# EAGLE design MAR (EAGLE 9.5.2)
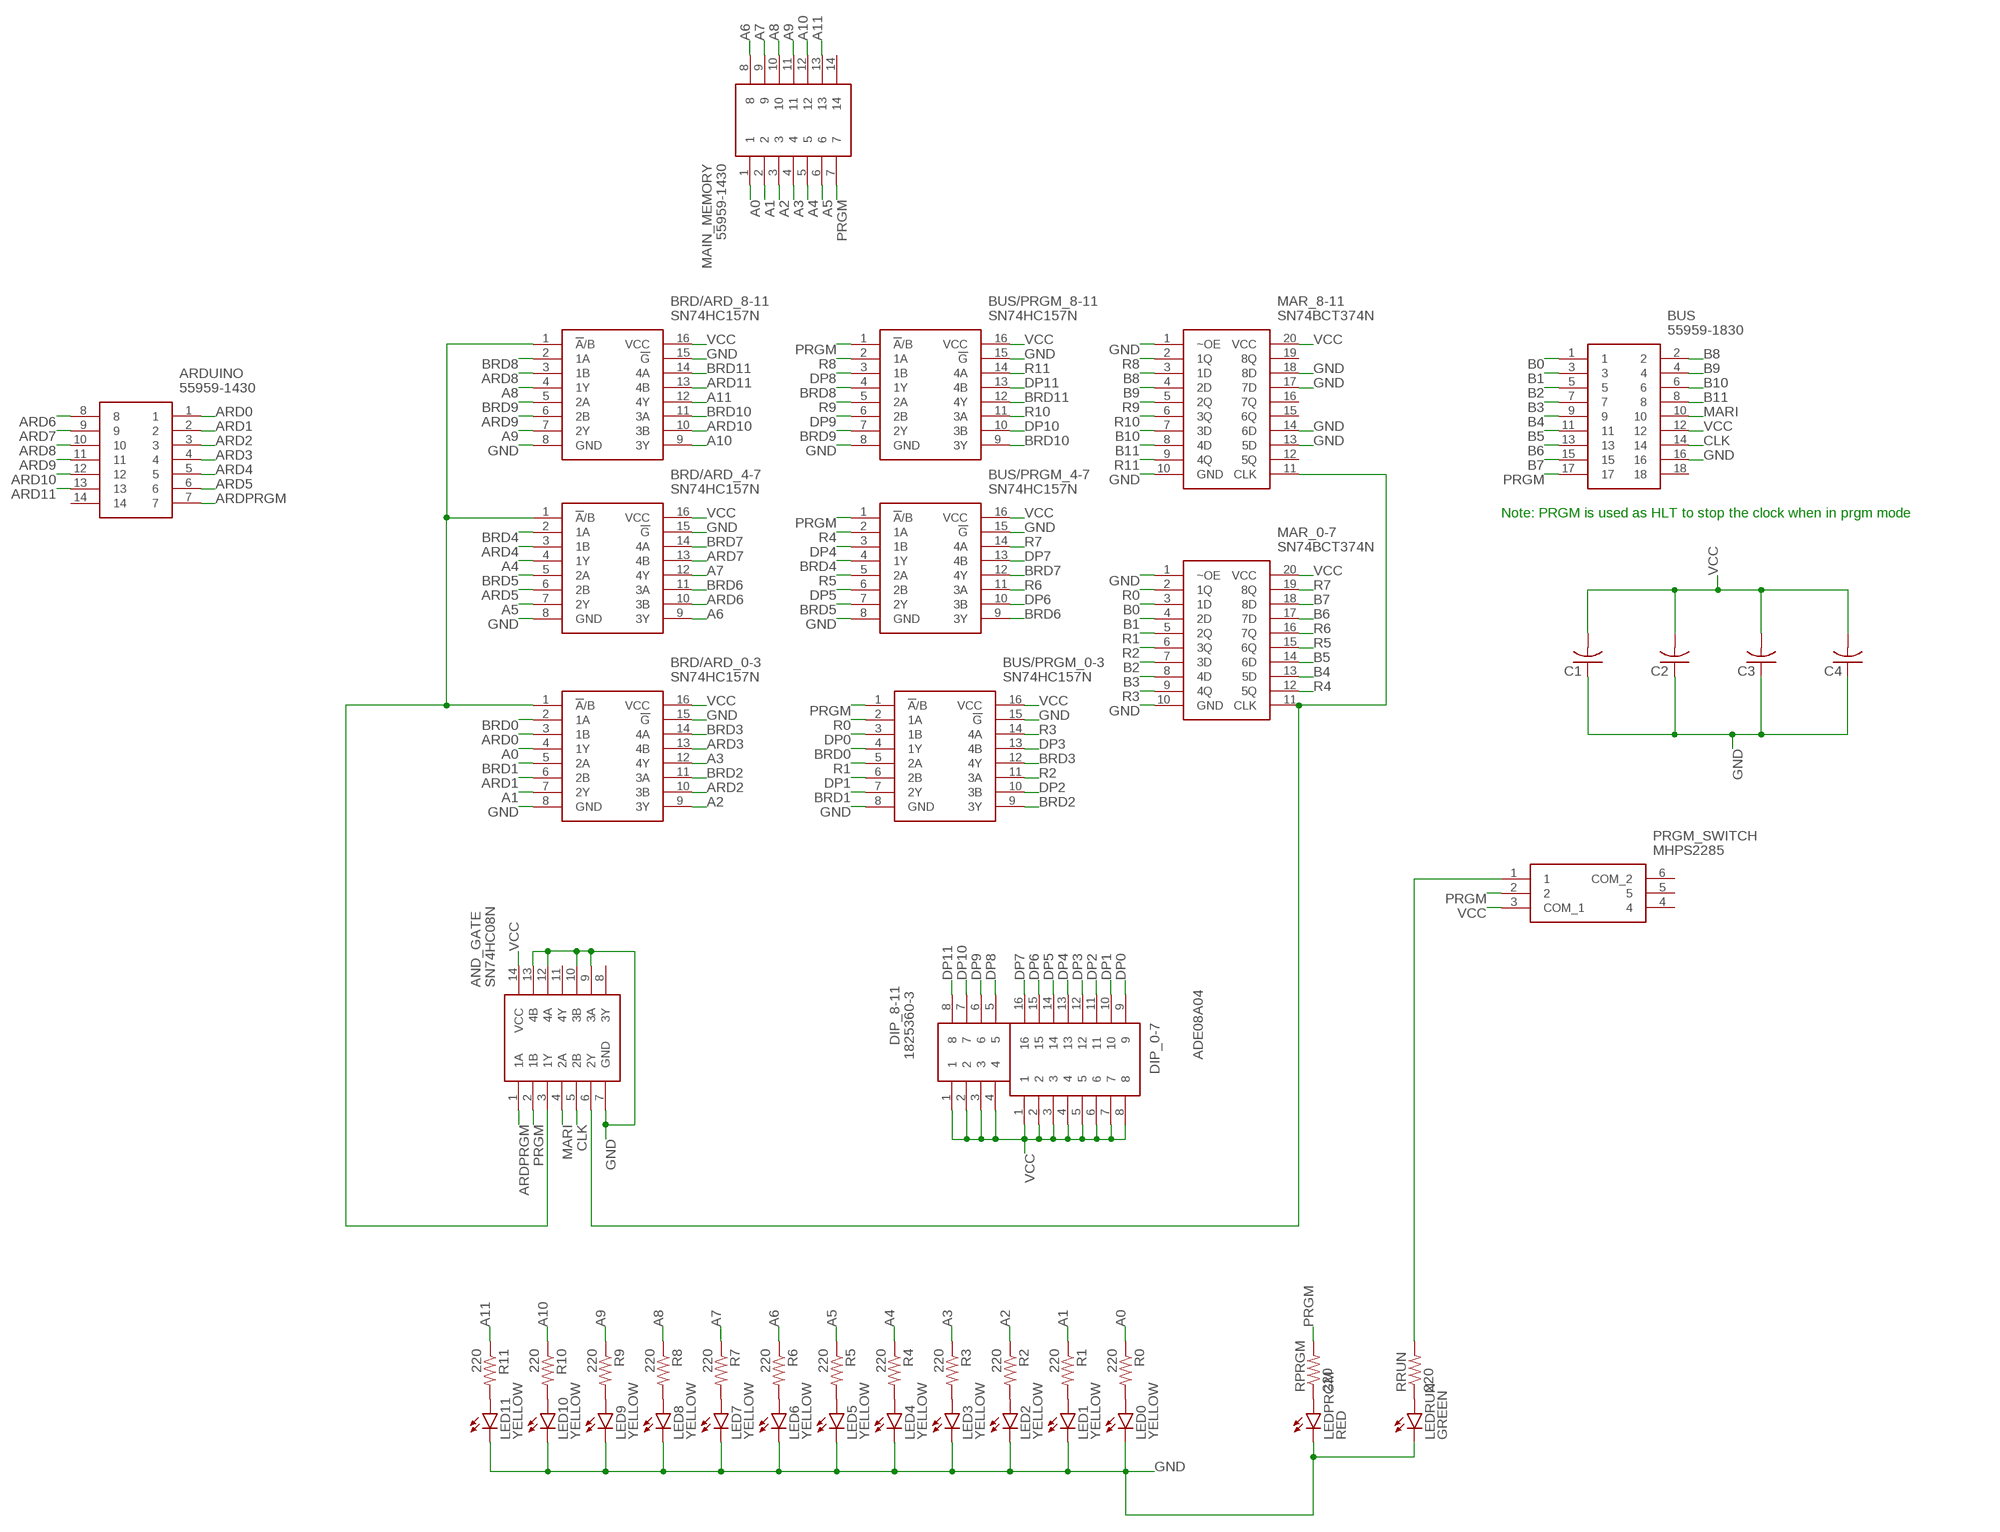
[diagram p0: schematic, sheet 1]

## Parts
AND_GATE  SN74HC08N  [DIP794W53P254L1930H508Q14N]
ARDUINO  55959-1430  [559591430]
BRD/ARD_0-3  SN74HC157N  [DIP794W53P254L1930H508Q16N]
BRD/ARD_4-7  SN74HC157N  [DIP794W53P254L1930H508Q16N]
BRD/ARD_8-11  SN74HC157N  [DIP794W53P254L1930H508Q16N]
BUS  55959-1830  [SHDR18W65P250X200_2X9_2140X140]
BUS/PRGM_0-3  SN74HC157N  [DIP794W53P254L1930H508Q16N]
BUS/PRGM_4-7  SN74HC157N  [DIP794W53P254L1930H508Q16N]
BUS/PRGM_8-11  SN74HC157N  [DIP794W53P254L1930H508Q16N]
C1  C-US025-024X044  [C025-024X044]
C2  C-US025-024X044  [C025-024X044]
C3  C-US025-024X044  [C025-024X044]
C4  C-US025-024X044  [C025-024X044]
DIP_0-7  ADE08A04  [DIP810W60P254L2225H590Q16N]
DIP_8-11  1825360-3  [DIP813W61P254L1209H351Q8N]
LED0  YELLOW  LED3MM  [LED3MM]
LED1  YELLOW  LED3MM  [LED3MM]
LED2  YELLOW  LED3MM  [LED3MM]
LED3  YELLOW  LED3MM  [LED3MM]
LED4  YELLOW  LED3MM  [LED3MM]
LED5  YELLOW  LED3MM  [LED3MM]
LED6  YELLOW  LED3MM  [LED3MM]
LED7  YELLOW  LED3MM  [LED3MM]
LED8  YELLOW  LED3MM  [LED3MM]
LED9  YELLOW  LED3MM  [LED3MM]
LED10  YELLOW  LED3MM  [LED3MM]
LED11  YELLOW  LED3MM  [LED3MM]
LEDPRGM  RED  LED3MM  [LED3MM]
LEDRUN  GREEN  LED3MM  [LED3MM]
MAIN_MEMORY  55959-1430  [559591430]
MAR_0-7  SN74BCT374N  [DIP254P762X508-20]
MAR_8-11  SN74BCT374N  [DIP254P762X508-20]
PRGM_SWITCH  MHPS2285  [MHPS2285]
R0  220  R-US_0204/7  [0204/7]
R1  220  R-US_0204/7  [0204/7]
R2  220  R-US_0204/7  [0204/7]
R3  220  R-US_0204/7  [0204/7]
R4  220  R-US_0204/7  [0204/7]
R5  220  R-US_0204/7  [0204/7]
R6  220  R-US_0204/7  [0204/7]
R7  220  R-US_0204/7  [0204/7]
R8  220  R-US_0204/7  [0204/7]
R9  220  R-US_0204/7  [0204/7]
R10  220  R-US_0204/7  [0204/7]
R11  220  R-US_0204/7  [0204/7]
RPRGM  220  R-US_0204/7  [0204/7]
RRUN  220  R-US_0204/7  [0204/7]

## Nets
A0: BRD/ARD_0-3.4(1Y) MAIN_MEMORY.1 R0.1
A1: BRD/ARD_0-3.7(2Y) MAIN_MEMORY.2 R1.1
A2: BRD/ARD_0-3.9(3Y) MAIN_MEMORY.3 R2.1
A3: BRD/ARD_0-3.12(4Y) MAIN_MEMORY.4 R3.1
A4: BRD/ARD_4-7.4(1Y) MAIN_MEMORY.5 R4.1
A5: BRD/ARD_4-7.7(2Y) MAIN_MEMORY.6 R5.1
A6: BRD/ARD_4-7.9(3Y) MAIN_MEMORY.8 R6.1
A7: BRD/ARD_4-7.12(4Y) MAIN_MEMORY.9 R7.1
A8: BRD/ARD_8-11.4(1Y) MAIN_MEMORY.10 R8.1
A9: BRD/ARD_8-11.7(2Y) MAIN_MEMORY.11 R9.1
A10: BRD/ARD_8-11.9(3Y) MAIN_MEMORY.12 R10.1
A11: BRD/ARD_8-11.12(4Y) MAIN_MEMORY.13 R11.1
ARD0: ARDUINO.1 BRD/ARD_0-3.3(1B)
ARD1: ARDUINO.2 BRD/ARD_0-3.6(2B)
ARD2: ARDUINO.3 BRD/ARD_0-3.10(3B)
ARD3: ARDUINO.4 BRD/ARD_0-3.13(4B)
ARD4: ARDUINO.5 BRD/ARD_4-7.3(1B)
ARD5: ARDUINO.6 BRD/ARD_4-7.6(2B)
ARD6: ARDUINO.8 BRD/ARD_4-7.10(3B)
ARD7: ARDUINO.9 BRD/ARD_4-7.13(4B)
ARD8: ARDUINO.10 BRD/ARD_8-11.3(1B)
ARD9: ARDUINO.11 BRD/ARD_8-11.6(2B)
ARD10: ARDUINO.12 BRD/ARD_8-11.10(3B)
ARD11: ARDUINO.13 BRD/ARD_8-11.13(4B)
ARDPRGM: AND_GATE.1(1A) ARDUINO.7
B0: BUS.1 MAR_0-7.3(1D)
B1: BUS.3 MAR_0-7.4(2D)
B2: BUS.5 MAR_0-7.7(3D)
B3: BUS.7 MAR_0-7.8(4D)
B4: BUS.9 MAR_0-7.13(5D)
B5: BUS.11 MAR_0-7.14(6D)
B6: BUS.13 MAR_0-7.17(7D)
B7: BUS.15 MAR_0-7.18(8D)
B8: BUS.2 MAR_8-11.3(1D)
B9: BUS.4 MAR_8-11.4(2D)
B10: BUS.6 MAR_8-11.7(3D)
B11: BUS.8 MAR_8-11.8(4D)
BRD0: BRD/ARD_0-3.2(1A) BUS/PRGM_0-3.4(1Y)
BRD1: BRD/ARD_0-3.5(2A) BUS/PRGM_0-3.7(2Y)
BRD2: BRD/ARD_0-3.11(3A) BUS/PRGM_0-3.9(3Y)
BRD3: BRD/ARD_0-3.14(4A) BUS/PRGM_0-3.12(4Y)
BRD4: BRD/ARD_4-7.2(1A) BUS/PRGM_4-7.4(1Y)
BRD5: BRD/ARD_4-7.5(2A) BUS/PRGM_4-7.7(2Y)
BRD6: BRD/ARD_4-7.11(3A) BUS/PRGM_4-7.9(3Y)
BRD7: BRD/ARD_4-7.14(4A) BUS/PRGM_4-7.12(4Y)
BRD8: BRD/ARD_8-11.2(1A) BUS/PRGM_8-11.4(1Y)
BRD9: BRD/ARD_8-11.5(2A) BUS/PRGM_8-11.7(2Y)
BRD10: BRD/ARD_8-11.11(3A) BUS/PRGM_8-11.9(3Y)
BRD11: BRD/ARD_8-11.14(4A) BUS/PRGM_8-11.12(4Y)
CLK: AND_GATE.5(2B) BUS.14
DP0: BUS/PRGM_0-3.3(1B) DIP_0-7.9
DP1: BUS/PRGM_0-3.6(2B) DIP_0-7.10
DP2: BUS/PRGM_0-3.10(3B) DIP_0-7.11
DP3: BUS/PRGM_0-3.13(4B) DIP_0-7.12
DP4: BUS/PRGM_4-7.3(1B) DIP_0-7.13
DP5: BUS/PRGM_4-7.6(2B) DIP_0-7.14
DP6: BUS/PRGM_4-7.10(3B) DIP_0-7.15
DP7: BUS/PRGM_4-7.13(4B) DIP_0-7.16
DP8: BUS/PRGM_8-11.3(1B) DIP_8-11.5
DP9: BUS/PRGM_8-11.6(2B) DIP_8-11.6
DP10: BUS/PRGM_8-11.10(3B) DIP_8-11.7
DP11: BUS/PRGM_8-11.13(4B) DIP_8-11.8
GND: AND_GATE.7(GND) AND_GATE.9(3A) AND_GATE.10(3B) AND_GATE.12(4A) AND_GATE.13(4B) BRD/ARD_0-3.8(GND) BRD/ARD_0-3.15(!G) BRD/ARD_4-7.8(GND) BRD/ARD_4-7.15(!G) BRD/ARD_8-11.8(GND) BRD/ARD_8-11.15(!G) BUS.16 BUS/PRGM_0-3.8(GND) BUS/PRGM_0-3.15(!G) BUS/PRGM_4-7.8(GND) BUS/PRGM_4-7.15(!G) BUS/PRGM_8-11.8(GND) BUS/PRGM_8-11.15(!G) C1.1 C2.1 C3.1 C4.1 LED0.K(C) LED1.K(C) LED2.K(C) LED3.K(C) LED4.K(C) LED5.K(C) LED6.K(C) LED7.K(C) LED8.K(C) LED9.K(C) LED10.K(C) LED11.K(C) LEDPRGM.K(C) LEDRUN.K(C) MAR_0-7.1(~OE) MAR_0-7.10(GND) MAR_8-11.1(~OE) MAR_8-11.10(GND) MAR_8-11.13(5D) MAR_8-11.14(6D) MAR_8-11.17(7D) MAR_8-11.18(8D)
MARI: AND_GATE.4(2A) BUS.10
N$1: AND_GATE.3(1Y) BRD/ARD_0-3.1(!A!/B) BRD/ARD_4-7.1(!A!/B) BRD/ARD_8-11.1(!A!/B)
N$2: AND_GATE.6(2Y) MAR_0-7.11(CLK) MAR_8-11.11(CLK)
N$3: LED1.A R1.2
N$4: LED2.A R2.2
N$5: LED3.A R3.2
N$6: LED4.A R4.2
N$7: LED5.A R5.2
N$8: LED6.A R6.2
N$9: LED7.A R7.2
N$10: LED8.A R8.2
N$12: LEDPRGM.A RPRGM.1
N$13: LEDRUN.A RRUN.1
N$14: PRGM_SWITCH.1 RRUN.2
N$15: LED9.A R9.2
N$16: LED10.A R10.2
N$17: LED11.A R11.2
N$22: LED0.A R0.2
PRGM: AND_GATE.2(1B) BUS.17 BUS/PRGM_0-3.1(!A!/B) BUS/PRGM_4-7.1(!A!/B) BUS/PRGM_8-11.1(!A!/B) MAIN_MEMORY.7 PRGM_SWITCH.2 RPRGM.2
R0: BUS/PRGM_0-3.2(1A) MAR_0-7.2(1Q)
R1: BUS/PRGM_0-3.5(2A) MAR_0-7.5(2Q)
R2: BUS/PRGM_0-3.11(3A) MAR_0-7.6(3Q)
R3: BUS/PRGM_0-3.14(4A) MAR_0-7.9(4Q)
R4: BUS/PRGM_4-7.2(1A) MAR_0-7.12(5Q)
R5: BUS/PRGM_4-7.5(2A) MAR_0-7.15(6Q)
R6: BUS/PRGM_4-7.11(3A) MAR_0-7.16(7Q)
R7: BUS/PRGM_4-7.14(4A) MAR_0-7.19(8Q)
R8: BUS/PRGM_8-11.2(1A) MAR_8-11.2(1Q)
R9: BUS/PRGM_8-11.5(2A) MAR_8-11.5(2Q)
R10: BUS/PRGM_8-11.11(3A) MAR_8-11.6(3Q)
R11: BUS/PRGM_8-11.14(4A) MAR_8-11.9(4Q)
VCC: AND_GATE.14(VCC) BRD/ARD_0-3.16(VCC) BRD/ARD_4-7.16(VCC) BRD/ARD_8-11.16(VCC) BUS.12 BUS/PRGM_0-3.16(VCC) BUS/PRGM_4-7.16(VCC) BUS/PRGM_8-11.16(VCC) C1.2 C2.2 C3.2 C4.2 DIP_0-7.1 DIP_0-7.2 DIP_0-7.3 DIP_0-7.4 DIP_0-7.5 DIP_0-7.6 DIP_0-7.7 DIP_0-7.8 DIP_8-11.1 DIP_8-11.2 DIP_8-11.3 DIP_8-11.4 MAR_0-7.20(VCC) MAR_8-11.20(VCC) PRGM_SWITCH.3(COM_1)
Unconnected: AND_GATE.8(3Y) AND_GATE.11(4Y) ARDUINO.14 BUS.18 MAIN_MEMORY.14 MAR_8-11.12(5Q) MAR_8-11.15(6Q) MAR_8-11.16(7Q) MAR_8-11.19(8Q) PRGM_SWITCH.4 PRGM_SWITCH.5 PRGM_SWITCH.6(COM_2)

## Notes on the sheet
- Note: PRGM is used as HLT to stop the clock when in prgm mode

## Library data of the parts
AND_GATE = SamacSys_Parts:SN74HC08N: QUADRUPLE 2-INPUT POSITIVE-NOR GATES Source: Datasheet <http://componentsearchengine.com/Datasheets/1/SN74HC08N.pdf>; DESCRIPTION: QUADRUPLE 2-INPUT POSITIVE-NOR GATES; HEIGHT: 5.08mm; MANUFACTURER_NAME: Texas Instruments; MANUFACTURER_PART_NUMBER: SN74HC08N; MOUSER_PART_NUMBER: 595-SN74HC08N; MOUSER_PRICE-STOCK: https://www.mouser.com/Search/Refine.aspx?Keyword=595-SN74HC08N
ARDUINO MAIN_MEMORY = SamacSys_Parts:55959-1430: Molex MICROCLASP 55959, 2mm Pitch, 14 Way, 2 Row, Right Angle PCB Header, Through Hole Source: Datasheet <https://componentsearchengine.com/Datasheets/1/55959-1430.pdf>; DESCRIPTION: Molex MICROCLASP 55959, 2mm Pitch, 14 Way, 2 Row, Right Angle PCB Header, Through Hole; HEIGHT: 11.7mm; MANUFACTURER_NAME: Molex; MANUFACTURER_PART_NUMBER: 55959-1430; MOUSER_PART_NUMBER: 538-55959-1430; MOUSER_PRICE-STOCK: https://www.mouser.com/Search/Refine.aspx?Keyword=538-55959-1430
BRD/ARD_0-3 BRD/ARD_4-7 BRD/ARD_8-11 BUS/PRGM_0-3 BUS/PRGM_4-7 BUS/PRGM_8-11 = SamacSys_Parts:SN74HC157N: Quadruple 2-Line To 1-Line Data Selectors/Multiplexers Source: Datasheet <http://www.ti.com/lit/gpn/sn74hc157>; DESCRIPTION: Quadruple 2-Line To 1-Line Data Selectors/Multiplexers; HEIGHT: 5.08mm; MANUFACTURER_NAME: Texas Instruments; MANUFACTURER_PART_NUMBER: SN74HC157N; MOUSER_PART_NUMBER: 595-SN74HC157N; MOUSER_PRICE-STOCK: https://www.mouser.com/Search/Refine.aspx?Keyword=595-SN74HC157N
BUS = SamacSys_Parts:55959-1830: Molex MICROCLASP Series, Series Number 55959, 2mm Pitch 18 Way 2 Row Right Angle PCB Header, Solder Termination, 3A Source: Datasheet <https://componentsearchengine.com/Datasheets/1/55959-1830.pdf>; DESCRIPTION: Molex MICROCLASP Series, Series Number 55959, 2mm Pitch 18 Way 2 Row Right Angle PCB Header, Solder Termination, 3A; HEIGHT: 11.7mm; MANUFACTURER_NAME: Molex; MANUFACTURER_PART_NUMBER: 55959-1830; MOUSER_PART_NUMBER: 538-55959-1830; MOUSER_PRICE-STOCK: https://www.mouser.com/Search/Refine.aspx?Keyword=538-55959-1830
C1-C4 = rcl:C-US: CAPACITOR, American symbol; SPICEPREFIX: C
DIP_0-7 = SamacSys_Parts:ADE08A04: 8 Way Through Hole DIP Switch SPST, Extended Slide Actuator Source: Datasheet <https://componentsearchengine.com/Datasheets/1/ADE08A04.pdf>; DESCRIPTION: 8 Way Through Hole DIP Switch SPST, Extended Slide Actuator; HEIGHT: 5.9mm; MANUFACTURER_NAME: TE Connectivity; MANUFACTURER_PART_NUMBER: ADE08A04; MOUSER_PART_NUMBER: 506-ADE08A04; MOUSER_PRICE-STOCK: https://www.mouser.com/Search/Refine.aspx?Keyword=506-ADE08A04
DIP_8-11 = SamacSys_Parts:1825360-3: DIP switch,PCB,SPST,4 pos,extended slide Source: Datasheet <https://componentsearchengine.com/Datasheets/1/1825360-3.pdf>; DESCRIPTION: DIP switch,PCB,SPST,4 pos,extended slide; HEIGHT: 3.51mm; MANUFACTURER_NAME: TE Connectivity; MANUFACTURER_PART_NUMBER: 1825360-3; MOUSER_PART_NUMBER: 506-1825360-3; MOUSER_PRICE-STOCK: https://www.mouser.com/Search/Refine.aspx?Keyword=506-1825360-3
LED0 LED1-LED11 LEDPRGM LEDRUN = led:LED: LED OSRAM: - CHIPLED LG R971, LG N971, LY N971, LG Q971, LY Q971, LO R971, LY R971 LH N974, LH R974 LS Q976, LO Q976, LY Q976 LO Q996 - Hyper CHIPLED LW Q18S LB Q993, LB Q99A, LB R99A - SideLED LS A670, LO A670, LY A670, LG A670, LP A670 LB A673, LV A673, LT A673, LW A673 LH A674 LY A675 LS A676, LA A676, LO A676, LY A676, LW A676 LS A679, LY A679, LG A679 - Hyper Micro SIDELED® LS Y876, LA Y876, LO Y876, LY Y876 LT Y87S - SmartLED LW L88C, LW L88S LB L89C, LB L89S, LG L890 LS L89K, LO L89K, LY L89K LS L896, LA L896, LO L896, LY L896 - TOPLED LS T670, LO T670, LY T670, LG T670, LP T670 LSG T670, LSP T670, LSY T670, LOP T670, LYG T670 LG T671, LOG T671, LSG T671 LB T673, LV T673, LT T673, LW T673 LH T674 LS T676, LA T676, LO T676, LY T676, LB T676, LH T676, LSB T676, LW T676 LB T67C, LV T67C, LT T67C, LS T67K, LO T67K, LY T67K, LW E67C LS E67B, LA E67B, LO E67B, LY E67B, LB E67C, LV E67C, LT E67C LW T67C LS T679, LY T679, LG T679 LS T770, LO T770, LY T770, LG T770, LP T770 LB T773, LV T773, LT T773, LW T773 LH T774 LS E675, LA E675, LY E675, LS T675 LS T776, LA T776, LO T776, LY T776, LB T776 LHGB T686 LT T68C, LB T68C - Hyper Mini TOPLED® LB M676 - Mini TOPLED Santana® LG M470 LS M47K, LO M47K, LY M47K Source: http://www.osram.convergy.de LUXEON: - LUMILED® LXK2-PW12-R00, LXK2-PW12-S00, LXK2-PW14-U00, LXK2-PW14-V00 LXK2-PM12-R00, LXK2-PM12-S00, LXK2-PM14-U00 LXK2-PE12-Q00, LXK2-PE12-R00, LXK2-PE12-S00, LXK2-PE14-T00, LXK2-PE14-U00 LXK2-PB12-K00, LXK2-PB12-L00, LXK2-PB12-M00, LXK2-PB14-N00, LXK2-PB14-P00, LXK2-PB14-Q00 LXK2-PR12-L00, LXK2-PR12-M00, LXK2-PR14-Q00, LXK2-PR14-R00 LXK2-PD12-Q00, LXK2-PD12-R00, LXK2-PD12-S00 LXK2-PH12-R00, LXK2-PH12-S00 LXK2-PL12-P00, LXK2-PL12-Q00, LXK2-PL12-R00 Source: www.luxeon.com KINGBRIGHT: KA-3528ASYC Source: www.kingbright.com
MAR_0-7 MAR_8-11 = SamacSys_Parts:SN74BCT374N: OCTAL EDGE TRIGGERED D TYPE LATCHES Source: Datasheet; DESCRIPTION: OCTAL EDGE TRIGGERED D TYPE LATCHES; HEIGHT: mm; MANUFACTURER_NAME: Texas Instruments; MANUFACTURER_PART_NUMBER: SN74BCT374N; MOUSER_PART_NUMBER: 595-SN74BCT374N; MOUSER_PRICE-STOCK: https://www.mouser.com/Search/Refine.aspx?Keyword=595-SN74BCT374N
PRGM_SWITCH = SamacSys_Parts:MHPS2285: Pushbutton Switches 8mmDPDT PUSH PUSH Source: Datasheet <https://componentsearchengine.com/Datasheets/1/MHPS2285.pdf>; DESCRIPTION: Pushbutton Switches 8mmDPDT PUSH PUSH; HEIGHT: 13.5mm; MANUFACTURER_NAME: Apem; MANUFACTURER_PART_NUMBER: MHPS2285; MOUSER_PART_NUMBER: 642-MHPS2285; MOUSER_PRICE-STOCK: https://www.mouser.com/Search/Refine.aspx?Keyword=642-MHPS2285
R0 R1-R11 RPRGM RRUN = rcl:R-US_: RESISTOR, American symbol; SPICEPREFIX: R

## Board
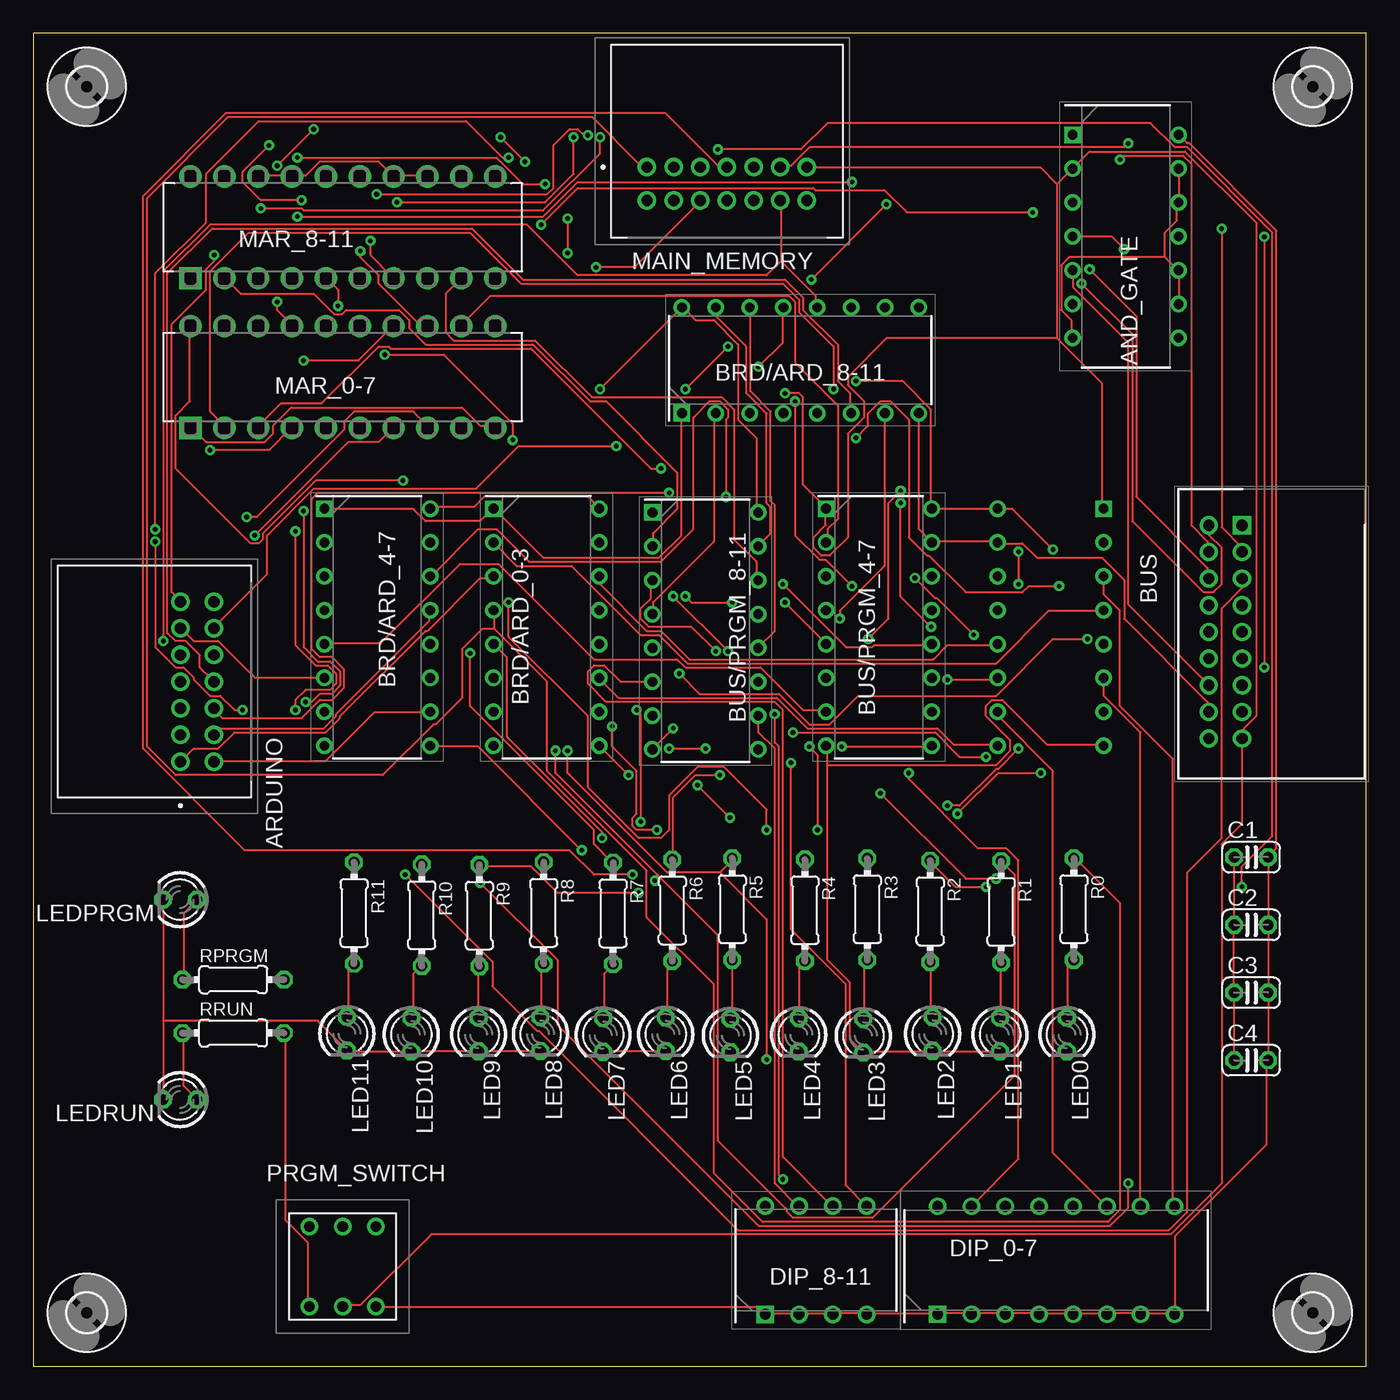
[diagram p1: board, top side]
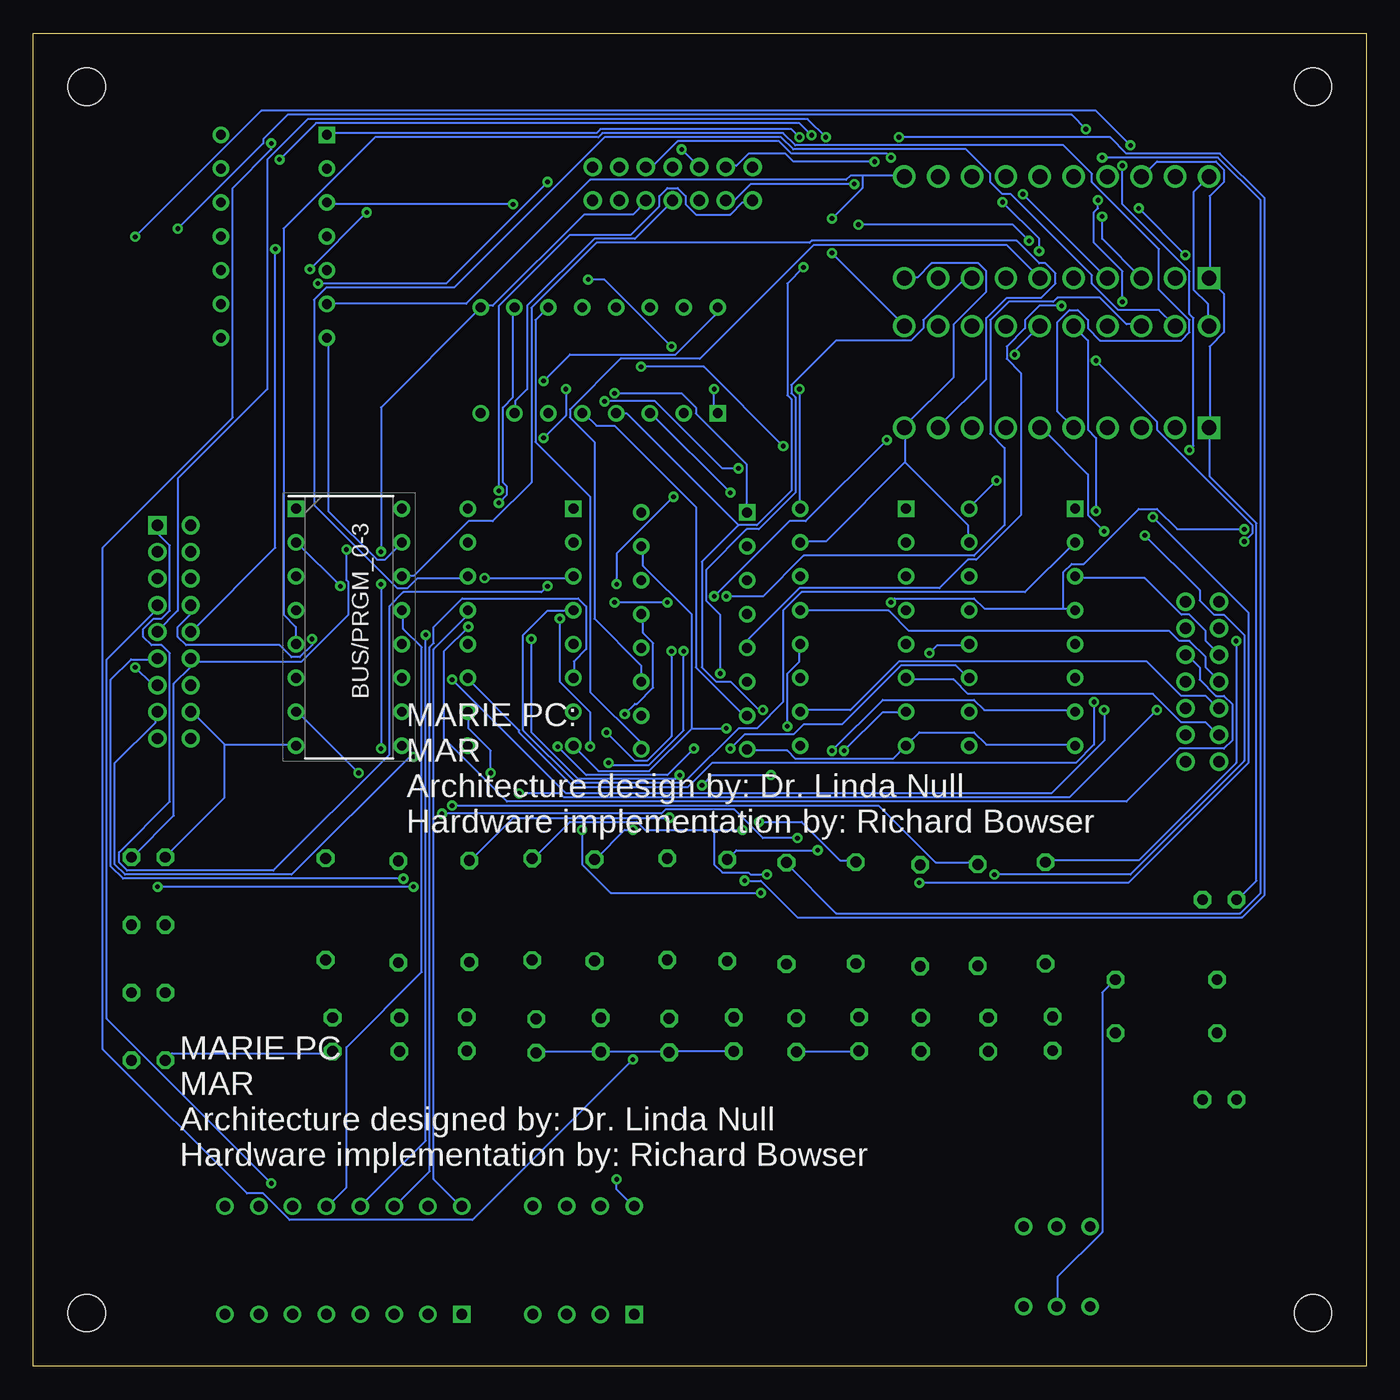
[diagram p2: board, bottom side, seen from below]

Size 100 x 100 mm. Coordinates in mm from the lower left corner, seen from the top.
Outline: 0,0 100,0 100,100 0,100 0,0
Copper layers (1*16): Top 0.035mm / dielectric 1.5mm / Bottom 0.035mm
Design rules "default": minimum track width 6mil, minimum drill 0.35mm, track to track 6mil, track to pad 6mil, pad to pad 6mil, via to via 6mil, smd to smd 6mil, copper to edge 40mil, drill to drill 6mil, minimum pad ring 10mil, minimum via ring 8mil, stop-mask expansion 4mil, vias tented up to drill 0mil, thermal gap 10mil

### Footprints (pad centres in the part's own frame; a part is rotated, then mirrored left to right if it is on the bottom)
DIP794W53P254L1930H508Q14N = drill 0.73 pad 1.13 square: 1 -3.97,7.62 | drill 0.73 pad 1.13: 2 -3.97,5.08; 3 -3.97,2.54; 4 -3.97,0; 5 -3.97,-2.54; 6 -3.97,-5.08; 7 -3.97,-7.62; 8 3.97,-7.62; 9 3.97,-5.08; 10 3.97,-2.54; 11 3.97,0; 12 3.97,2.54; 13 3.97,5.08; 14 3.97,7.62
559591430 = drill 0.85 pad 1.381: 1 0,0; 2 2,0; 3 4,0; 4 6,0; 5 8,0; 6 10,0; 7 12,0; 8 0,-2.5; 9 2,-2.5; 10 4,-2.5; 11 6,-2.5; 12 8,-2.5; 13 10,-2.5; 14 12,-2.5
DIP794W53P254L1930H508Q16N = drill 0.73 pad 1.13 square: 1 -3.97,8.89 | drill 0.73 pad 1.13: 2 -3.97,6.35; 3 -3.97,3.81; 4 -3.97,1.27; 5 -3.97,-1.27; 6 -3.97,-3.81; 7 -3.97,-6.35; 8 -3.97,-8.89; 9 3.97,-8.89; 10 3.97,-6.35; 11 3.97,-3.81; 12 3.97,-1.27; 13 3.97,1.27; 14 3.97,3.81; 15 3.97,6.35; 16 3.97,8.89
SHDR18W65P250X200_2X9_2140X140 = drill 0.85 pad 1.275 square: 1 0,0 | drill 0.85 pad 1.275: 2 0,-2.5; 3 2,0; 4 2,-2.5; 5 4,0; 6 4,-2.5; 7 6,0; 8 6,-2.5; 9 8,0; 10 8,-2.5; 11 10,0; 12 10,-2.5; 13 12,0; 14 12,-2.5; 15 14,0; 16 14,-2.5; 17 16,0; 18 16,-2.5
C025-024X044 = drill 0.813 octagon: 1 -1.27,0; 2 1.27,0
DIP810W60P254L2225H590Q16N = drill 0.8 pad 1.2 square: 1 -4.05,8.89 | drill 0.8 pad 1.2: 2 -4.05,6.35; 3 -4.05,3.81; 4 -4.05,1.27; 5 -4.05,-1.27; 6 -4.05,-3.81; 7 -4.05,-6.35; 8 -4.05,-8.89; 9 4.05,-8.89; 10 4.05,-6.35; 11 4.05,-3.81; 12 4.05,-1.27; 13 4.05,1.27; 14 4.05,3.81; 15 4.05,6.35; 16 4.05,8.89
DIP813W61P254L1209H351Q8N = drill 0.81 pad 1.21 square: 1 -4.065,3.81 | drill 0.81 pad 1.21: 2 -4.065,1.27; 3 -4.065,-1.27; 4 -4.065,-3.81; 5 4.065,-3.81; 6 4.065,-1.27; 7 4.065,1.27; 8 4.065,3.81
LED3MM = drill 0.813 octagon: A -1.27,0; K 1.27,0
DIP254P762X508-20 = drill 1.118 pad 1.676 square: 1 -7.62,22.86 | drill 1.118 pad 1.676: 2 -7.62,20.32; 3 -7.62,17.78; 4 -7.62,15.24; 5 -7.62,12.7; 6 -7.62,10.16; 7 -7.62,7.62; 8 -7.62,5.08; 9 -7.62,2.54; 10 -7.62,0; 11 0,0; 12 0,2.54; 13 0,5.08; 14 0,7.62; 15 0,10.16; 16 0,12.7; 17 0,15.24; 18 0,17.78; 19 0,20.32; 20 0,22.86
MHPS2285 = drill 0.8 pad 1.3: 1 0,0; 2 2.5,0; 3 5,0; 4 5,6; 5 2.5,6; 6 0,6
0204/7 = drill 0.813 octagon: 1 -3.81,0; 2 3.81,0
2,8 = hole 2.8: 0,0

### Placement (x,y rotation side)
AND_GATE  81.95,84.77 0 top
ARDUINO  11.04,45.36 90 top
BRD/ARD_0-3  38.5,55.45 0 top
BRD/ARD_4-7  25.8,55.45 0 top
BRD/ARD_8-11  57.55,75.47 90 top
BUS  90.69,63.09 270 top
BUS/PRGM_0-3  76.32,55.45 0 bottom
BUS/PRGM_4-7  63.44,55.45 0 top
BUS/PRGM_8-11  50.42,55.16 0 top
C1  91.37,38.19 0 top
C2  91.37,33.11 0 top
C3  91.37,28.03 0 top
C4  91.37,22.95 0 top
DIP_0-7  76.74,7.95 90 top
DIP_8-11  58.72,7.95 90 top
LED0  77.54,24.88 270 top
LED1  72.53,24.89 270 top
LED2  67.47,24.93 270 top
LED3  62.27,24.78 270 top
LED4  57.42,24.86 270 top
LED5  52.3,24.81 270 top
LED6  47.45,24.9 270 top
LED7  42.75,24.85 270 top
LED8  38.05,24.92 270 top
LED9  33.41,24.89 270 top
LED10  28.35,24.88 270 top
LED11  23.52,24.94 270 top
LEDPRGM  11,35 180 top
LEDRUN  11,20 180 top
MAIN_MEMORY  46.04,89.96 0 top
MAR_0-7  34.65,78.03 90 top
MAR_8-11  34.65,89.25 90 top
PRGM_SWITCH  20.71,4.47 0 top
R0  78.07,34.3 270 top
R1  72.61,34.09 270 top
R2  67.29,34.12 270 top
R3  62.58,34.28 270 top
R4  57.89,34.2 270 top
R5  52.44,34.29 270 top
R6  47.94,34.2 270 top
R7  43.49,33.98 270 top
R8  38.29,34.01 270 top
R9  33.46,33.8 270 top
R10  29.14,33.84 270 top
R11  24.06,34 270 top
RPRGM  15,29 0 top
RRUN  15,25 0 top
U$1  [2,8]  4,4 0 top
U$2  [2,8]  96,4 0 top
U$3  [2,8]  96,96 0 top
U$4  [2,8]  4,96 0 top

### Tracks (layer width: path | path; a pad name or v marks a point on that pad's centre or on a via)
A0
  Top 0.152: 34.59,55.32 34.59,56.69 BRD/ARD_0-3.4 | 34.59,55.32 38.56,51.36 38.56,44.65 46.02,37.19 46.02,33.68 51.05,28.65 51.05,14.48 54.71,10.82 80.62,10.82 81.53,11.73 81.53,34.75 78.18,38.1 R0.1 | 34.59,55.32 33.68,55.32 32.16,53.8 32.16,50.14 30.18,48.16 30.02,48.16 26.21,44.35 10.67,44.35 8.53,46.48 8.53,87.63 14.63,93.73 41.91,93.73 45.57,90.07 46.02,90.07 MAIN_MEMORY.1
A1  (via drill 0.35)
  Top 0.152: v39.17,46.18 39.17,44.5 46.94,36.73 | 46.94,36.73 51.36,32.31 51.36,16.92 56.54,11.73 56.54,11.58 57,11.12 62.94,11.12 73.61,21.79 73.61,36.88 72.69,37.8 R1.1 | v35.05,92.2 v36.88,90.37 | 46.94,36.73 v46.63,36.42
  Bottom 0.152: v39.17,46.18 36.27,49.07 34.59,49.07 BRD/ARD_0-3.7 | v36.88,90.37 42.98,90.37 43.59,90.98 46.33,90.98 47.24,90.07 48.01,90.07 MAIN_MEMORY.2 | v35.05,92.2 19.2,92.2 17.98,90.98 10.97,90.98 7.62,87.63 7.62,35.36 9.3,33.68 42.67,33.68 45.41,36.42 v46.63,36.42
A2  (via drill 0.35)
  Top 0.152: v44.65,44.35 42.52,46.48 BRD/ARD_0-3.9 | v52.27,41.15 v49.84,43.59 | v51.36,91.29 57.61,91.29 59.59,93.27 83.82,93.27 85.65,91.44 86.56,91.44 92.96,85.04 92.96,39.78 90.68,37.49 v90.68,35.97 | v71.48,35.97 69.19,35.97 67.36,37.8 R2.1
  Bottom 0.152: v44.65,44.35 49.07,44.35 v49.84,43.59 | v52.27,41.15 64.01,41.15 67.21,37.95 R2.1 | v51.36,91.29 50.14,90.07 MAIN_MEMORY.3 | v71.48,35.97 v90.68,35.97
A3  (via drill 0.35)
  Top 0.152: v43.43,48.01 43.43,46.48 45.26,44.65 45.26,41.45 44.96,41.15 44.96,40.54 45.26,40.23 v46.79,40.23 | v44.96,36.88 42.06,36.88 40.23,38.71 15.85,38.71 8.23,46.33 8.23,87.78 14.48,94.03 47.4,94.03 51.36,90.07 51.97,90.07 MAIN_MEMORY.4
  Bottom 0.152: v43.43,48.01 43.43,51.97 42.52,52.88 42.52,54.1 BRD/ARD_0-3.12 | 48.92,40.23 54.1,40.23 54.71,40.84 59.74,40.84 62.48,38.1 R3.1 | 48.92,40.23 v46.79,40.23 | v44.96,36.88 46.18,36.88 46.33,37.03 48.31,37.03 48.92,37.64 48.92,40.23
A4  (via drill 0.35)
  Top 0.152: v35.66,57.3 35.66,54.71 41.6,48.77 41.6,43.43 45.41,39.62 47.09,39.62 47.7,40.23 47.7,42.82 49.84,44.96 51.82,44.96 55.02,41.76 v55.02,40.23 | v35.66,90.68 35.2,90.68 32.46,93.42 16.92,93.42 12.95,89.46 12.95,85.8 9.14,81.99 v9.14,62.79
  Bottom 0.152: 22.71,56.84 28.65,56.84 29.41,57.61 35.36,57.61 v35.66,57.3 | 22.71,56.84 21.95,56.84 BRD/ARD_4-7.4 | v55.02,40.23 55.63,40.23 57.76,38.1 R4.1 | v35.66,90.68 35.97,90.98 43.13,90.98 44.04,91.9 51.66,91.9 53.49,90.07 53.95,90.07 MAIN_MEMORY.5 | v9.14,62.79 14.17,62.79 15.7,64.31 17.07,64.31 21.18,60.2 22.1,60.2 22.71,59.59 22.71,56.84
A5  (via drill 0.35)
  Top 0.152: v40.08,46.18 40.08,44.5 47.55,37.03 51.51,37.03 | 51.51,37.03 52.43,37.95 R5.1 | v82.14,91.75 81.84,91.44 58.22,91.44 56.84,90.07 56.08,90.07 MAIN_MEMORY.6 | v55.02,23.01 55.02,33.53 51.51,37.03
  Bottom 0.152: v40.08,46.18 36.27,49.99 29.41,49.99 28.65,49.23 21.95,49.23 BRD/ARD_4-7.7 | v82.14,91.75 82.14,91.29 85.04,88.39 85.04,71.17 94.79,61.42 94.79,23.77 83.97,12.95 82.75,12.95 80.77,10.97 67.06,10.97 v55.02,23.01
A6  (via drill 0.35)
  Top 0.152: v41.15,38.71 33.38,46.48 29.87,46.48 BRD/ARD_4-7.9 | v65.08,65.68 64.16,64.77 64.16,56.08 v62.64,54.56 | v51.51,44.35 49.68,44.35 48.01,42.67 48.01,38.1 R6.1
  Bottom 0.152: v41.15,38.71 47.24,38.71 47.85,38.1 R6.1 | v65.08,65.68 65.08,79.55 59.74,84.89 55.17,84.89 53.03,87.02 53.03,87.78 52.43,88.39 51.66,88.39 51.05,87.78 51.05,87.17 50.29,86.41 47.7,86.41 46.79,87.33 46.18,87.33 MAIN_MEMORY.8 | v62.64,54.56 62.64,47.55 59.13,44.04 51.82,44.04 v51.51,44.35
A7  (via drill 0.35)
  Top 0.152: v32.77,53.49 32.77,49.53 42.06,40.23 42.06,39.17 43.43,37.8 R7.1 | v38.41,88.7 36.73,88.7 34.75,90.68 v19.81,90.68
  Bottom 0.152: v32.77,53.49 32.16,54.1 29.87,54.1 BRD/ARD_4-7.12 | v38.41,88.7 46.18,88.7 47.4,87.48 48.01,87.48 MAIN_MEMORY.9 | v19.81,90.68 11.12,90.68 7.92,87.48 7.92,35.51 9.45,33.98 39.78,33.98 43.43,37.64 R7.1
A8  (via drill 0.35)
  Top 0.152: v42.22,82.45 45.11,82.45 49.99,87.33 MAIN_MEMORY.10 | v45.57,40.84 45.57,48.92 v45.26,49.23
  Bottom 0.152: 47.09,63.09 55.47,71.48 56.24,71.48 BRD/ARD_8-11.4 | 47.09,63.09 45.72,63.09 43.13,65.68 43.13,72.54 43.43,72.85 43.43,81.23 v42.22,82.45 | v45.57,40.84 42.37,40.84 39.47,37.95 38.41,37.95 R8.1 | v45.26,49.23 45.57,49.23 47.7,51.36 48.77,51.36 49.84,52.43 49.84,60.35 47.09,63.09
A9  (via drill 0.35)
  Top 0.152: v45.41,35.51 39.32,35.51 37.34,37.49 33.53,37.49 R9.1 | v58.83,40.23 58.83,45.87 v58.22,46.48 | v60.5,56.08 60.5,56.69 63.86,60.05 63.86,71.48 BRD/ARD_8-11.7
  Bottom 0.152: BRD/ARD_8-11.7 63.86,71.63 63.86,72.39 62.94,73.3 62.94,79.55 57.91,84.58 54.86,84.58 52.12,87.33 MAIN_MEMORY.11 | v45.41,35.51 56.69,35.51 58.83,37.64 v58.83,40.23 | v58.22,46.48 58.22,49.07 60.5,51.36 v60.5,56.08
A10  (via drill 0.35)
  Top 0.152: v68.58,42.06 69.49,42.06 72.24,44.81 72.39,44.81 v73.91,46.33 | v73.91,61.11 v73.91,58.67
  Bottom 0.152: MAIN_MEMORY.12 54.1,87.33 55.02,86.41 58.67,86.41 65.53,79.55 66.29,79.55 BRD/ARD_8-11.9 66.45,79.4 73.91,71.93 v73.91,61.11 | v68.58,42.06 36.58,42.06 32.31,37.8 29.26,37.8 R10.1 | v73.91,58.67 v73.91,46.33
A11  (via drill 0.35)
  Top 0.152: 56.08,82.91 58.67,80.31 58.67,79.55 BRD/ARD_8-11.12 | 56.08,82.91 56.08,87.33 MAIN_MEMORY.13 | v9.75,54.41 9.75,82.14 13.26,85.65 37.03,85.65 40.84,81.84 55.02,81.84 56.08,82.91
  Bottom 0.152: v9.75,54.41 9.75,45.26 17.07,37.95 23.93,37.95 R11.1
ARD0
  Top 0.152: BRD/ARD_0-3.3 34.44,59.13 33.53,59.13 29.57,55.17 29.41,55.17 23.01,48.77 23.01,48.62 21.95,47.55 15.09,47.55 13.87,46.33 12.04,46.33 11.12,45.41 ARDUINO.1
ARD1
  Bottom 0.152: BRD/ARD_0-3.6 34.44,51.51 30.94,51.51 29.87,50.44 16,50.44 13.87,48.31 12.04,48.31 11.12,47.4 ARDUINO.2
ARD2
  Bottom 0.152: BRD/ARD_0-3.10 42.37,49.23 38.71,49.23 35.05,52.88 16.46,52.88 13.87,50.29 12.04,50.29 11.12,49.38 ARDUINO.3
ARD3
  Bottom 0.152: BRD/ARD_0-3.13 42.37,56.69 35.81,56.69 34.29,55.17 14.78,55.17 14.02,54.41 13.26,54.41 12.04,53.19 12.04,52.43 11.12,51.51 ARDUINO.4
ARD4
  Bottom 0.152: BRD/ARD_4-7.3 21.79,59.13 16.61,59.13 13.87,56.39 13.26,56.39 12.04,55.17 12.04,54.41 11.12,53.49 ARDUINO.5
ARD5
  Top 0.152: BRD/ARD_4-7.6 21.79,51.66 16.61,51.66 13.87,54.41 12.04,54.41 11.12,55.32 ARDUINO.6
ARD6
  Top 0.152: BRD/ARD_4-7.10 29.72,49.07 25.6,49.07 21.95,45.41 13.56,45.41 ARDUINO.8
ARD7
  Top 0.152: BRD/ARD_4-7.13 29.72,56.69 29.72,55.93 22.71,48.92 22.71,48.77 21.79,47.85 14.02,47.85 13.56,47.4 ARDUINO.9
ARD8  (via drill 0.35)
  Top 0.152: v47.7,65.53 21.34,65.53 20.88,65.08 20.88,53.8 21.49,53.19 22.4,53.19 23.32,52.27 23.32,50.9 22.4,49.99 21.49,49.99 20.12,48.62 14.17,48.62 13.56,49.23 ARDUINO.10
  Bottom 0.152: v47.7,65.53 53.65,71.48 BRD/ARD_8-11.3
ARD9
  Top 0.152: BRD/ARD_8-11.6 61.27,71.63 61.27,73 60.35,73.91 60.35,76.66 57.76,79.25 57.76,80.16 56.39,81.53 36.73,81.53 32.92,85.34 13.41,85.34 10.06,81.99 10.06,55.02 10.67,54.41 11.43,54.41 12.5,53.34 12.5,52.43 13.41,51.51 ARDUINO.11
ARD10  (via drill 0.35)
  Top 0.152: v65.08,64.77 65.08,57.76 v67.36,55.47
  Bottom 0.152: v65.08,64.77 64.47,65.38 64.47,65.99 64.77,66.29 64.77,71.93 64.01,72.69 64.01,79.4 BRD/ARD_8-11.10 | v67.36,55.47 69.19,53.65 69.19,47.09 64.47,42.37 17.98,42.37 14.02,46.33 10.67,46.33 10.06,46.94 10.06,49.68 10.67,50.29 11.28,50.29 12.5,51.51 12.5,52.43 13.41,53.34 ARDUINO.12
ARD11  (via drill 0.35)
  Top 0.152: v54.41,74.98 56.24,76.81 56.24,79.4 BRD/ARD_8-11.13 | v43.74,69.04 36.42,69.04 33.22,65.84 21.03,65.84 17.53,62.33 17.53,59.44 13.56,55.47 ARDUINO.13
  Bottom 0.152: v54.41,74.98 49.68,74.98 v43.74,69.04
ARDPRGM  (via drill 0.35)
  Top 0.152: v42.52,92.2 42.52,90.98 38.25,86.72 20.27,86.72 20.12,86.87 v17.07,86.87 | v13.56,83.36 13.56,82.91 12.95,82.3 12.95,80.77 10.36,78.18 10.36,58.06 10.97,57.45 ARDUINO.7
  Bottom 0.152: v42.52,92.2 43.13,92.81 57.45,92.81 57.76,92.51 77.88,92.51 AND_GATE.1 | v13.56,83.36 v17.07,86.87
B0  (via drill 0.35)
  Top 0.152: v61.42,58.52 59.44,60.5 58.98,60.5 57.15,62.33 v57.15,72.39 | v47.09,67.36 46.33,67.36 37.34,76.35 26.82,76.35 26.67,76.5 25.91,76.5 21.64,72.24 18.59,72.24 16.92,70.56 MAR_0-7.3
  Bottom 0.152: v61.42,58.52 61.87,58.06 72.24,58.06 73.3,57 73.3,45.87 81.99,37.19 92.96,37.19 93.57,37.8 93.57,38.56 89.76,42.37 89.76,53.49 90.37,54.1 91.14,54.1 91.75,54.71 91.75,55.32 90.98,56.08 90.37,56.08 89.76,56.69 89.76,61.57 90.68,62.48 90.68,62.94 BUS.1 | v57.15,72.39 53.34,72.39 48.31,67.36 v47.09,67.36
B1  (via drill 0.35)
  Top 0.152: v89.15,85.34 89.15,62.94 90.68,61.42 90.68,61.11 BUS.3 | v18.29,90.07 v21.03,92.81 | v13.26,68.73 17.68,68.73 19.36,70.41 MAR_0-7.4
  Bottom 0.152: v89.15,85.34 82.75,91.75 82.75,92.05 80.92,93.88 22.1,93.88 v21.03,92.81 | v18.29,90.07 18.29,87.17 13.26,82.14 13.26,78.94 12.95,78.64 12.95,69.04 v13.26,68.73
B2  (via drill 0.35)
  Top 0.152: v27.89,36.88 34.44,30.33 34.44,28.5 37.8,25.15 37.95,25.15 52.88,10.21 85.19,10.21 86.56,11.58 86.56,37.03 89.15,39.62 89.15,56.84 90.68,58.37 90.68,58.98 BUS.5 | v16.61,62.33 23.62,69.34 25.91,69.34 26.98,70.41 MAR_0-7.7
  Bottom 0.152: v27.89,36.88 17.68,36.88 9.14,45.41 9.14,54.86 10.67,56.39 11.43,56.39 12.5,57.45 12.5,58.22 v16.61,62.33
B3  (via drill 0.35)
  Top 0.152: v82.14,13.72 82.14,11.89 80.77,10.52 54.41,10.52 39.32,25.6 39.32,30.48 v33.53,36.27 | v16,63.7 16.76,63.7 23.32,70.26 23.32,70.87 24.08,71.63 28.5,71.63 29.57,70.56 MAR_0-7.8
  Bottom 0.152: v82.14,13.72 94.49,26.06 94.49,53.03 90.83,56.69 90.83,57 BUS.7 | v33.53,36.27 17.83,36.27 8.84,45.26 8.84,56.54 v16,63.7
B4  (via drill 0.35)
  Top 0.152: v40.54,92.2 40.54,89.46 38.41,87.33 v27.28,87.33 | v24.54,83.67 24.54,83.21 25.91,81.84 25.91,81.23 28.96,78.18 29.57,78.18 MAR_0-7.13
  Bottom 0.152: v40.54,92.2 41.91,93.57 79.4,93.57 82.45,90.53 82.45,73.3 89.15,66.6 89.15,56.69 90.68,55.17 BUS.9 | v27.28,87.33 24.54,84.58 v24.54,83.67
B5  (via drill 0.35)
  Top 0.152: v72.24,36.58 69.95,36.58 v63.55,42.98 | v15.7,49.23 15.09,49.23 14.02,50.29 13.26,50.29 12.04,51.51 12.04,51.66 11.28,52.43 10.67,52.43 9.14,53.95 v9.14,61.87 | v20.27,75.44 24.38,75.44 26.98,78.03 MAR_0-7.14
  Bottom 0.152: v72.24,36.58 93.27,36.58 94.18,37.49 94.18,51.51 92.66,53.03 90.83,53.03 BUS.11 | v63.55,42.98 60.5,42.98 60.2,42.67 22.25,42.67 v15.7,49.23 | v9.14,61.87 8.53,62.48 8.53,63.09 15.7,70.26 15.7,70.87 v20.27,75.44
B6  (via drill 0.35)
  Top 0.152: v92.35,84.73 v92.35,52.43 | v17.68,91.59 15.7,89.61 15.7,88.85 17.07,87.48 v20.12,87.48 | v18.29,79.86 18.29,79.25 19.36,78.18 MAR_0-7.17
  Bottom 0.152: v92.35,52.43 91.14,51.21 90.83,51.21 BUS.13 | v92.35,84.73 82.91,94.18 20.27,94.18 v17.68,91.59 | v20.12,87.48 20.12,86.87 20.42,86.56 20.42,84.28 18.29,82.14 v18.29,79.86
B7  (via drill 0.35)
  Top 0.152: v71.48,45.72 69.49,45.72 67.67,47.55 v57,47.55 | v48.01,57.76 v52.12,53.65
  Bottom 0.152: v71.48,45.72 71.78,45.72 80.62,36.88 93.12,36.88 93.88,37.64 93.88,45.26 90.83,48.31 90.83,49.07 BUS.15 | v57,47.55 54.86,45.41 53.95,45.41 52.12,47.24 v52.12,53.65 | v48.01,57.76 45.26,57.76 42.22,60.81 29.41,60.81 27.13,63.09 27.13,68.89 28.19,69.95 28.19,78.49 26.82,79.86 23.47,79.86 23.16,80.16 19.96,80.16 17.98,78.18 16.92,78.18 MAR_0-7.18
B8  (via drill 0.35)
  Top 0.152: v78.64,81.23 82.45,77.42 82.45,63.4 87.78,58.06 88.54,58.06 89.15,58.67 89.15,61.42 88.24,62.33 88.24,62.94 BUS.2 | v61.42,88.85 40.84,88.85 38.25,86.26 v19.81,86.26
  Bottom 0.152: v78.64,81.23 69.04,81.23 v61.42,88.85 | v19.81,86.26 19.81,84.58 16.92,81.69 MAR_8-11.3
B9  (via drill 0.35)
  Top 0.152: v81.53,90.53 81.84,90.83 86.26,90.83 86.87,90.22 86.87,63.09 88.09,61.87 88.09,61.11 BUS.4 | v41.6,92.35 41.3,92.35 40.84,92.81 40.23,92.81 39.01,91.59 39.01,88.39 38.56,87.94 v25.76,87.94
  Bottom 0.152: v81.53,90.53 78.79,93.27 42.52,93.27 v41.6,92.35 | v25.76,87.94 19.51,81.69 MAR_8-11.4
B10  (via drill 0.35)
  Top 0.152: v79.25,82.3 82.75,78.79 82.75,65.23 88.09,59.89 88.09,59.13 BUS.6 | v74.98,86.56 65.53,86.56 63.86,88.24 58.67,88.24 58.52,88.39 40.84,88.39 v38.1,85.65 | v25.3,84.43 25.3,83.36 26.98,81.69 MAR_8-11.7
  Bottom 0.152: v74.98,86.56 v79.25,82.3 | v38.1,85.65 26.52,85.65 v25.3,84.43
B11  (via drill 0.35)
  Top 0.152: v79.1,54.56 76.5,54.56 72.24,50.29 61.87,50.29 59.74,48.16 58.22,48.16 55.93,50.44 49.99,50.44 v48.46,51.97
  Bottom 0.152: v79.1,54.56 79.1,54.1 80.01,53.19 80.62,53.19 81.53,54.1 88.54,54.1 89.15,54.71 89.15,55.47 88.24,56.39 88.24,57 BUS.8 | v48.46,51.97 48.46,56.39 49.53,57.45 49.53,59.74 46.48,62.79 45.57,62.79 42.82,65.53 42.82,72.69 43.13,73 43.13,73.61 39.78,76.96 34.14,76.96 33.22,77.88 33.22,78.49 30.18,81.53 29.72,81.53 MAR_8-11.8
BRD0
  Top 0.152: BUS/PRGM_0-3.4 80.16,56.69 76.2,56.69 72.24,52.73 49.07,52.73 46.94,54.86 45.57,54.86 40.39,60.05 36.27,60.05 34.59,61.72 BRD/ARD_0-3.2
BRD1  (via drill 0.35)
  Top 0.152: v75.59,44.5 72.39,44.5 v69.34,41.45 | v42.67,39.62 42.67,40.08 35.51,47.24 35.51,53.19 34.59,54.1 BRD/ARD_0-3.5
  Bottom 0.152: v75.59,44.5 80.16,49.07 BUS/PRGM_0-3.7 | v69.34,41.45 52.88,41.45 52.58,41.76 47.4,41.76 45.26,39.62 v42.67,39.62
BRD2
  Top 0.152: BUS/PRGM_0-3.9 72.24,46.63 69.04,46.63 67.82,47.85 58.06,47.85 55.78,50.14 43.89,50.14 42.52,51.51 BRD/ARD_0-3.11
BRD3
  Top 0.152: BUS/PRGM_0-3.12 72.24,54.1 68.58,54.1 67.51,53.03 49.23,53.03 47.09,55.17 46.02,55.17 42.52,58.67 42.52,59.13 BRD/ARD_0-3.14
BRD4
  Bottom 0.152: BUS/PRGM_4-7.4 59.59,56.69 61.42,56.69 63.25,54.86 63.25,47.7 59.28,43.74 51.21,43.74 47.09,47.85 45.72,47.85 43.74,49.84 43.74,56.69 42.37,58.06 25.6,58.06 21.95,61.72 BRD/ARD_4-7.2
BRD5
  Top 0.152: BUS/PRGM_4-7.7 59.44,49.23 57.76,49.23 54.56,52.43 48.92,52.43 48.31,53.03 42.06,53.03 34.9,60.2 32,60.2 26.06,54.25 21.95,54.25 BRD/ARD_4-7.5
BRD6  (via drill 0.35)
  Top 0.152: v60.66,46.48 67.36,46.48 BUS/PRGM_4-7.9 | v47.7,46.33 v50.44,46.33
  Bottom 0.152: v60.66,46.48 58.52,44.35 52.43,44.35 v50.44,46.33 | v47.7,46.33 46.63,47.4 42.98,47.4 42.22,48.16 39.32,48.16 34.9,52.58 30.79,52.58 29.87,51.66 BRD/ARD_4-7.11
BRD7  (via drill 0.35)
  Top 0.152: v56.24,58.67 60.96,53.95 62.94,53.95 63.09,54.1 67.36,54.1 BUS/PRGM_4-7.12 | v51.97,65.23 51.97,71.02 52.12,71.17 52.12,71.78 51.51,72.39 50.75,72.39 49.53,71.17 49.53,62.79 47.09,60.35 37.19,60.35 34.75,62.79 33.38,62.79 29.87,59.28 BRD/ARD_4-7.14
  Bottom 0.152: v56.24,58.67 56.24,60.96 v51.97,65.23
BRD8
  Top 0.152: BUS/PRGM_8-11.4 46.48,56.54 46.48,57.3 51.05,61.87 51.05,71.48 BRD/ARD_8-11.2
BRD9
  Bottom 0.152: BUS/PRGM_8-11.7 46.48,48.92 46.79,48.92 50.29,52.43 50.29,64.47 56.39,70.56 57.76,70.56 58.67,71.48 BRD/ARD_8-11.5
BRD10
  Bottom 0.152: BUS/PRGM_8-11.9 54.41,46.33 54.41,46.79 58.22,50.6 58.22,65.23 62.33,69.34 62.33,78.49 61.42,79.4 BRD/ARD_8-11.11
BRD11
  Top 0.152: BRD/ARD_8-11.14 53.8,79.4 53.8,73.15 55.32,71.63 55.32,64.92 55.63,64.62 55.63,55.17 54.41,53.95 BUS/PRGM_8-11.12
CLK
  Top 0.152: AND_GATE.5 78.03,82.14 78.03,80.92 82.14,76.81 82.14,57.15 88.09,51.21 BUS.14
DP0
  Top 0.152: BUS/PRGM_0-3.3 80.31,59.13 80.31,57.91 81.53,56.69 81.53,49.53 85.5,45.57 85.5,12.04 DIP_0-7.9
DP1
  Top 0.152: BUS/PRGM_0-3.6 80.31,51.51 80.31,50.29 83.06,47.55 83.06,12.04 DIP_0-7.10
DP2
  Top 0.152: BUS/PRGM_0-3.10 72.39,49.07 72.39,48.77 76.5,44.65 76.5,16 80.47,12.04 DIP_0-7.11
DP3
  Bottom 0.152: BUS/PRGM_0-3.13 72.24,56.69 72.24,55.32 70.87,53.95 70.87,29.57 76.5,23.93 76.5,13.41 77.88,12.04 DIP_0-7.12
DP4  (via drill 0.35)
  Top 0.152: v66.14,59.13 67.67,57.61 67.82,57.61 v70.56,54.86
  Bottom 0.152: v66.14,59.13 59.59,59.13 BUS/PRGM_4-7.3 | v70.56,54.86 70.56,16.92 75.44,12.04 DIP_0-7.13
DP5
  Bottom 0.152: BUS/PRGM_4-7.6 59.44,51.66 59.44,52.88 58.52,53.8 58.52,57 59.13,57.61 67.82,57.61 69.95,55.47 69.95,54.25 70.26,53.95 70.26,14.63 72.85,12.04 DIP_0-7.14
DP6  (via drill 0.35)
  Top 0.152: v65.68,44.5 65.68,44.04 70.87,38.86 73,38.86 73.91,37.95 73.91,15.54 70.41,12.04 DIP_0-7.15
  Bottom 0.152: v65.68,44.5 65.68,46.18 67.36,47.85 67.36,49.07 BUS/PRGM_4-7.10
DP7
  Bottom 0.152: BUS/PRGM_4-7.13 67.51,56.69 67.51,56.24 69.95,53.8 69.95,14.02 67.97,12.04 DIP_0-7.16
DP8  (via drill 0.35)
  Top 0.152: v51.21,53.65 49.38,55.47 46.18,55.47 45.57,56.08 45.57,56.84 46.33,57.61 46.33,58.83 BUS/PRGM_8-11.3 | v56.84,45.26 56.84,32.77 60.96,28.65 60.96,13.56 62.48,12.04 DIP_8-11.5
  Bottom 0.152: v51.21,53.65 51.21,47.7 53.8,45.11 56.69,45.11 v56.84,45.26
DP9
  Top 0.152: BUS/PRGM_8-11.6 46.33,51.36 44.04,51.36 42.82,52.58 42.06,52.58 41.6,52.12 41.6,51.21 42.98,49.84 55.63,49.84 56.24,49.23 56.24,15.7 59.89,12.04 DIP_8-11.6
DP10
  Top 0.152: BUS/PRGM_8-11.10 54.41,48.77 54.41,47.55 55.63,46.33 55.63,13.72 57.3,12.04 DIP_8-11.7
DP11  (via drill 0.35)
  Top 0.152: v55.63,48.92 55.63,46.79 55.93,46.48 55.93,14.33 v56.24,14.02
  Bottom 0.152: v55.63,48.92 54.86,49.68 54.71,49.68 53.49,50.9 53.49,54.25 54.25,55.02 54.25,56.39 BUS/PRGM_8-11.13 | v56.24,14.02 56.24,13.26 55.02,12.04 DIP_8-11.8
GND  (via drill 0.35)
  Top 0.152: C1.1 90.07,38.1 90.07,33.22 C2.1 90.07,33.07 90.07,28.04 C3.1 90.07,27.89 90.07,23.01 C4.1 | BRD/ARD_8-11.8 66.45,71.48 66.45,62.79 67.36,61.87 BUS/PRGM_4-7.15 67.51,61.87 72.24,61.87 BUS/PRGM_0-3.15 72.39,61.72 74.22,61.72 75.29,60.66 80.16,60.66 81.84,58.98 81.84,56.08 88.09,49.84 88.09,49.23 BUS.16 | AND_GATE.13 85.95,89.76 85.95,87.33 AND_GATE.12 85.8,87.17 85.8,85.95 84.89,85.04 84.89,83.21 | 84.89,83.21 77.72,83.21 77.11,82.6 77.11,79.25 77.88,78.49 77.88,77.27 AND_GATE.7 | 84.89,83.21 85.8,82.3 AND_GATE.10 85.95,82.14 85.95,79.7 AND_GATE.9 | MAR_8-11.18 16.92,89.31 19.36,89.31 MAR_8-11.17 19.51,89.31 20.42,89.31 21.49,90.37 25.91,90.37 26.98,89.31 MAR_8-11.14 27.13,89.31 29.57,89.31 MAR_8-11.13 | MAR_0-7.10 34.59,70.56 33.53,70.56 32.16,71.93 19.36,71.93 17.98,70.56 17.98,69.95 17.37,69.34 12.95,69.34 11.89,70.41 MAR_0-7.1 | 9.75,25.91 9.75,34.9 LEDPRGM.K | 9.75,25.91 9.75,20.12 LEDRUN.K | LED8.K 37.95,23.62 33.53,23.62 LED9.K 33.38,23.62 28.5,23.62 LED10.K 28.35,23.62 23.62,23.62 LED11.K 23.47,23.77 21.34,25.91 9.75,25.91 | LED7.K 42.82,23.62 47.4,23.62 LED6.K | BRD/ARD_8-11.15 51.21,79.4 51.21,78.79 53.49,76.5 53.49,73 55.02,71.48 55.02,64.77 55.32,64.47 55.32,62.48 54.41,61.57 BUS/PRGM_8-11.15 | LED1.K 72.39,23.62 67.51,23.62 LED2.K 67.36,23.62 62.33,23.62 LED3.K 62.18,23.62 61.27,24.54 61.27,28.8 59.59,30.48 59.59,45.11 | 59.59,45.11 59.59,46.48 BUS/PRGM_4-7.8 | v48.01,47.85 46.48,46.33 BUS/PRGM_8-11.8 | 59.59,45.11 72.24,45.11 73.3,46.18 73.3,46.94 71.48,48.77 71.48,49.53 71.93,49.99 72.69,49.99 76.05,46.63 80.16,46.63 BUS/PRGM_0-3.8
  Bottom 0.152: 85.65,46.63 80.31,46.63 BUS/PRGM_0-3.8 | 85.65,46.63 88.09,49.07 BUS.16 | LED0.K 77.57,23.47 89.61,23.47 90.07,23.01 C4.1 | 85.65,46.63 85.65,42.67 90.07,38.25 C1.1 | BUS/PRGM_0-3.15 72.39,61.72 73.61,60.5 74.22,60.5 77.88,64.16 77.88,77.11 AND_GATE.7 | 34.59,67.82 29.87,63.09 29.87,61.87 BRD/ARD_4-7.15 | 34.59,67.82 34.59,70.41 MAR_0-7.10 34.59,70.56 30.94,74.22 30.94,78.18 28.5,80.62 28.5,82.14 29.11,82.75 32.61,82.75 33.68,81.69 34.59,81.69 MAR_8-11.10 | 34.59,67.82 40.54,61.87 42.37,61.87 BRD/ARD_0-3.15 | MAR_8-11.18 16.76,89.31 15.7,90.37 11.28,90.37 10.67,89.76 10.67,88.85 11.73,87.78 11.73,81.69 MAR_8-11.1 11.73,81.53 10.67,80.47 10.67,77.57 11.73,76.5 11.73,70.56 MAR_0-7.1 11.73,70.41 11.73,66.75 8.23,63.25 8.23,36.42 9.6,35.05 LEDPRGM.K | LED6.K 47.55,23.62 52.27,23.62 LED5.K 52.43,23.62 57.3,23.62 LED4.K 57.45,23.62 62.18,23.62 LED3.K | LED8.K 38.1,23.62 42.67,23.62 LED7.K | BRD/ARD_4-7.8 21.95,46.63 28.5,46.63 29.41,47.55 33.53,47.55 34.44,46.63 BRD/ARD_0-3.8 34.59,46.48 35.51,45.57 42.82,45.57 43.43,46.18 46.33,46.18 BUS/PRGM_8-11.8 | 50.6,47.85 50.6,56.39 54.25,60.05 54.25,61.42 BUS/PRGM_8-11.15 | 50.6,47.85 53.8,44.65 57.61,44.65 59.44,46.48 BUS/PRGM_4-7.8 | 50.6,47.85 v48.01,47.85
MARI  (via drill 0.35)
  Top 0.152: v81.84,83.82 80.92,84.73 78.03,84.73 AND_GATE.4
  Bottom 0.152: v81.84,83.82 81.84,61.42 88.09,55.17 BUS.10
N$1  (via drill 0.35)
  Top 0.152: BRD/ARD_4-7.1 21.95,64.31 28.5,64.31 29.41,63.4 33.53,63.4 34.44,64.31 BRD/ARD_0-3.1 34.59,64.31 38.25,60.66 46.94,60.66 48.62,62.33 48.62,71.48 BRD/ARD_8-11.1 | v58.37,81.53 v64.01,87.17 | v48.92,73.3 v52.12,76.5
  Bottom 0.152: v64.01,87.17 77.88,87.17 AND_GATE.3 | v58.37,81.53 57.15,81.53 v52.12,76.5 | v48.92,73.3 48.92,71.78 48.77,71.63 BRD/ARD_8-11.1
N$2  (via drill 0.35)
  Top 0.152: v40.08,86.11 v40.08,83.52
  Bottom 0.152: 37.8,89.31 34.75,89.31 MAR_8-11.11 | 37.8,89.31 38.71,89.31 39.01,89 58.22,89 67.51,79.7 77.88,79.7 AND_GATE.6 | v40.08,83.52 34.75,78.18 MAR_0-7.11 | v40.08,86.11 37.8,88.39 37.8,89.31
N$3
  Top 0.152: LED1.A 72.54,26.21 72.54,30.18 R1.2
N$4
  Top 0.152: R2.2 67.36,30.18 67.36,26.21 LED2.A
N$5
  Top 0.152: LED3.A 62.33,26.06 62.33,30.18 62.48,30.33 R3.2
N$6
  Top 0.152: LED4.A 57.45,26.21 57.45,30.02 57.76,30.33 R4.2
N$7
  Top 0.152: LED5.A 52.43,26.21 52.43,30.33 R5.2
N$8
  Top 0.152: LED6.A 47.55,26.21 47.55,30.02 47.85,30.33 R6.2
N$9
  Top 0.152: LED7.A 42.82,26.21 42.82,29.41 43.43,30.02 R7.2
N$10
  Top 0.152: LED8.A 38.1,26.21 38.1,30.02 38.25,30.18 R8.2
N$12
  Top 0.152: RPRGM.1 11.28,29.11 11.28,33.98 12.19,34.9 LEDPRGM.A
N$13
  Top 0.152: RRUN.1 11.28,24.99 11.28,21.03 12.19,20.12 LEDRUN.A
N$14
  Top 0.152: PRGM_SWITCH.1 20.57,4.57 20.57,9.3 18.9,10.97 18.9,24.99 RRUN.2
N$15
  Top 0.152: LED9.A 33.38,26.21 33.38,29.87 R9.2
N$16
  Top 0.152: LED10.A 28.5,26.21 28.5,29.41 29.11,30.02 R10.2
N$17
  Top 0.152: LED11.A 23.62,26.36 23.62,29.87 23.93,30.18 R11.2
N$22
  Top 0.152: LED0.A 77.57,26.21 77.57,30.02 78.03,30.48 R0.2
PRGM  (via drill 0.35)
  Top 0.152: v56.39,73 57.45,73 57.76,72.69 57.76,66.14 59.44,64.47 BUS/PRGM_4-7.1 59.44,64.31 59.44,63.09 58.52,62.18 58.52,61.42 59.13,60.81 59.74,60.81 61.11,62.18 61.11,69.95 62.33,71.17 62.33,72.39 61.11,73.61 61.11,74.22 64.01,77.11 76.81,77.11 | 76.81,77.11 80.16,73.76 80.16,64.47 BUS/PRGM_0-3.1 | 76.81,88.7 76.81,77.11 | 76.81,88.7 77.88,89.76 AND_GATE.2 78.03,89.92 79.25,91.14 86.41,91.14 91.75,85.8 91.75,48.77 90.83,47.85 90.83,47.09 BUS.17 90.68,46.94 90.68,40.69 89.15,39.17 89.15,13.72 85.34,9.91 29.87,9.91 24.54,4.57 23.32,4.57 PRGM_SWITCH.2 | 76.81,88.7 75.59,89.92 58.06,89.92 MAIN_MEMORY.7
  Bottom 0.152: PRGM_SWITCH.2 23.16,4.57 23.16,6.71 19.81,10.06 19.81,28.04 18.9,28.96 RPRGM.2 | v56.39,73 51.36,73 50.29,71.93 50.29,71.48 46.48,67.67 46.48,64.16 BUS/PRGM_8-11.1
R0  (via drill 0.35)
  Top 0.152: v76.96,58.52 74.68,58.52 74.22,58.06 69.95,58.06 67.21,60.81 67.06,60.81 65.68,62.18 65.68,71.02 64.31,72.39 63.55,72.39 62.64,71.48 62.64,70.56 v61.72,69.65 | v60.05,73.3 60.05,76.5 57.45,79.1 57.45,80.01 56.24,81.23 36.58,81.23 32.77,85.04 16.15,85.04 13.26,82.14 13.26,71.63 14.33,70.56 MAR_0-7.2
  Bottom 0.152: v76.96,58.52 80.16,61.72 BUS/PRGM_0-3.2 | v61.72,69.65 60.05,71.32 v60.05,73.3
R1
  Bottom 0.152: BUS/PRGM_0-3.5 80.31,54.25 80.31,55.47 81.23,56.39 81.23,85.34 74.37,92.2 57.61,92.2 57.3,92.51 43.74,92.51 42.82,91.59 22.71,91.59 20.57,89.46 20.57,88.85 15.54,83.82 15.54,80.77 13.26,78.49 13.26,77.57 13.87,76.96 19.96,76.96 20.88,77.88 20.88,78.49 21.64,79.25 22.25,79.25 23.16,78.33 23.16,71.63 22.1,70.56 MAR_0-7.5
R2  (via drill 0.35)
  Top 0.152: v68.58,51.51 72.24,51.51 BUS/PRGM_0-3.11 | v19.66,49.23 19.66,49.99 20.42,50.75 22.25,50.75 22.71,51.21 22.71,51.97 22.1,52.58 21.18,52.58 19.66,54.1 v19.66,62.64
  Bottom 0.152: v68.58,51.51 60.05,42.98 23.62,42.98 19.66,46.94 v19.66,49.23 | v19.66,62.64 20.88,63.86 20.88,66.9 24.38,70.41 MAR_0-7.6
R3
  Bottom 0.152: BUS/PRGM_0-3.14 72.24,59.28 71.48,59.28 67.36,63.4 65.53,63.4 62.64,66.29 62.64,79.4 57.76,84.28 41.76,84.28 41.6,84.43 26.21,84.43 24.54,82.75 24.08,82.75 23.32,81.99 23.32,81.23 24.38,80.16 26.98,80.16 28.5,78.64 28.5,74.07 32,70.56 MAR_0-7.9
R4
  Top 0.152: BUS/PRGM_4-7.2 59.59,61.87 59.59,62.79 60.35,63.55 60.35,72.08 57.15,75.29 57.15,79.86 56.69,80.31 34.29,80.31 32.16,78.18 MAR_0-7.12
R5  (via drill 0.35)
  Top 0.152: v56.39,57.3 59.44,54.25 BUS/PRGM_4-7.5 | v52.43,57.3 49.38,57.3 v48.92,57.76 | v35.97,69.49 35.97,70.71 30.79,75.89 v26.36,75.89
  Bottom 0.152: v52.43,57.3 v56.39,57.3 | v48.92,57.76 43.28,63.4 42.06,63.4 v35.97,69.49 | v26.36,75.89 26.36,76.2 24.54,78.03 MAR_0-7.15
R6  (via drill 0.35)
  Top 0.152: v20.42,49.84 20.88,49.84 21.49,50.44 22.4,50.44 23.01,51.05 23.01,52.12 22.25,52.88 21.34,52.88 20.27,53.95 v20.27,64.16
  Bottom 0.152: v20.42,49.84 20.42,46.63 21.79,45.26 49.07,45.26 50.9,43.43 59.44,43.43 63.55,47.55 63.55,47.7 67.36,51.51 BUS/PRGM_4-7.11 | v20.27,64.16 20.27,69.65 20.88,70.26 20.88,76.96 MAR_0-7.16
R7
  Bottom 0.152: BUS/PRGM_4-7.14 67.51,59.13 71.17,59.13 71.93,58.37 72.69,58.37 78.94,64.62 78.94,80.01 78.03,80.92 68.43,80.92 57.15,92.2 43.89,92.2 42.98,91.29 30.02,91.29 28.19,89.46 28.19,88.85 27.28,87.94 26.67,87.94 20.57,81.84 20.57,81.23 18.59,79.25 15.54,79.25 14.48,78.18 MAR_0-7.19
R8
  Top 0.152: BUS/PRGM_8-11.2 46.48,61.57 46.48,62.48 48.31,64.31 48.31,67.06 42.98,72.39 41.76,72.39 37.49,76.66 29.41,76.66 28.19,77.88 28.19,78.49 27.43,79.25 23.47,79.25 23.16,78.94 22.55,78.94 21.03,80.47 15.54,80.47 14.48,81.53 MAR_8-11.2
R9  (via drill 0.35)
  Top 0.152: v22.86,79.55 22.86,80.77 22.1,81.53 MAR_8-11.5
  Bottom 0.152: v22.86,79.55 24.54,79.55 25.6,78.49 25.6,77.88 26.98,76.5 26.98,75.59 25.91,74.52 25.91,63.86 29.26,60.5 29.87,60.5 32,58.37 42.52,58.37 46.33,54.56 46.33,53.95 BUS/PRGM_8-11.5
R10
  Bottom 0.152: BUS/PRGM_8-11.11 54.41,51.36 54.41,52.58 57.91,56.08 57.91,69.34 59.74,71.17 59.74,71.78 55.93,75.59 49.99,75.59 41.45,84.12 26.98,84.12 24.54,81.69 MAR_8-11.6
R11
  Top 0.152: BUS/PRGM_8-11.14 54.25,58.98 54.25,60.35 52.58,62.03 52.58,71.78 51.66,72.69 41.91,72.69 37.64,76.96 31.55,76.96 30.94,77.57 30.94,80.47 32,81.53 MAR_8-11.9
VCC  (via drill 0.35)
  Top 0.152: BRD/ARD_4-7.16 29.87,64.47 33.07,64.47 33.83,65.23 41.6,65.23 42.37,64.47 BRD/ARD_0-3.16 | BUS/PRGM_8-11.16 54.25,64.16 54.25,69.65 52.88,71.02 52.88,76.66 51.05,78.49 49.68,78.49 48.77,79.4 BRD/ARD_8-11.16 48.62,79.4 v42.52,73.3 | v27.74,66.45 21.18,66.45 17.22,62.48 17.22,62.03 16.92,61.72 16.31,61.72 10.67,67.36 10.67,71.32 11.73,72.39 11.73,78.03 MAR_0-7.20 | PRGM_SWITCH.3 25.76,4.42 54.41,4.42 54.86,3.96 DIP_8-11.1 55.02,3.96 57.3,3.96 DIP_8-11.2 57.45,3.96 59.89,3.96 DIP_8-11.3 60.05,3.96 62.48,3.96 DIP_8-11.4 62.64,3.96 67.82,3.96 DIP_0-7.1 67.97,3.96 70.26,3.96 DIP_0-7.2 70.41,3.96 72.85,3.96 DIP_0-7.3 73,3.96 75.44,3.96 DIP_0-7.4 75.59,3.96 77.88,3.96 DIP_0-7.5 78.03,3.96 80.47,3.96 DIP_0-7.6 80.62,3.96 83.06,3.96 DIP_0-7.7 83.21,3.96 85.5,3.96 DIP_0-7.8 85.65,3.96 85.65,9.75 92.51,16.61 92.51,22.86 C4.2 92.66,23.01 92.66,27.89 C3.2 92.66,28.04 92.66,33.07 C2.2 92.66,33.22 92.66,38.1 C1.2 92.66,38.25 93.27,38.86 93.27,85.19 86.72,91.75 86.56,91.75 85.95,92.35 AND_GATE.14 | v76.5,61.27 73.46,64.31 72.39,64.31 BUS/PRGM_0-3.16 72.24,64.31 67.51,64.31 BUS/PRGM_4-7.16 67.36,64.47 67.36,71.78 65.23,73.91 v61.72,73.91
  Bottom 0.152: MAR_0-7.20 11.89,78.18 11.89,79.7 12.95,80.77 12.95,88.09 11.89,89.15 MAR_8-11.20 | v42.52,73.3 42.52,64.47 BRD/ARD_0-3.16 | v27.74,66.45 29.72,64.47 BRD/ARD_4-7.16 | 88.24,52.88 88.24,52.43 89.46,51.21 89.46,41.3 92.51,38.25 C1.2 | 88.24,52.88 88.24,53.03 BUS.12 88.24,52.88 | v76.5,61.27 76.5,58.98 76.35,58.83 76.35,56.39 79.86,52.88 88.24,52.88 | v61.72,73.91 59.74,75.89 51.82,75.89 48.77,78.94 48.77,79.4 BRD/ARD_8-11.16

### Text on the board
bNames: MARIE PC: / MAR / Architecture design by: Dr. Linda Null / Hardware implementation by: Richard Bowser | MARIE PC / MAR / Architecture designed by: Dr. Linda Null / Hardware implementation by: Richard Bowser